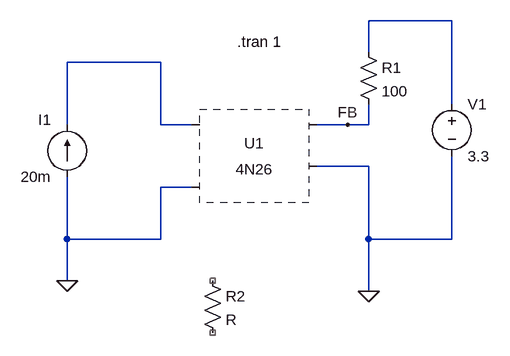
[diagram p0: schematic opto_trf.asc]
opto_trf.asc, the LTspice schematic file:
Version 4
SHEET 1 948 680
WIRE 848 -128 720 -128
WIRE 720 -80 720 -128
WIRE 400 -64 256 -64
WIRE 848 0 848 -128
WIRE 256 32 256 -64
WIRE 400 32 400 -64
WIRE 448 32 400 32
WIRE 688 32 640 32
WIRE 720 32 720 0
WIRE 720 32 688 32
WIRE 720 96 640 96
WIRE 448 128 400 128
WIRE 256 208 256 112
WIRE 400 208 400 128
WIRE 400 208 256 208
WIRE 720 208 720 96
WIRE 848 208 848 80
WIRE 848 208 720 208
WIRE 256 272 256 208
WIRE 720 288 720 208
FLAG 256 272 0
FLAG 720 288 0
FLAG 688 32 FB
SYMBOL current 256 112 R180
WINDOW 0 24 88 Left 0
WINDOW 3 24 0 Left 0
WINDOW 123 0 0 Left 0
WINDOW 39 0 0 Left 0
SYMATTR InstName I1
SYMATTR Value 20m
SYMBOL res 704 -96 R0
SYMATTR InstName R1
SYMATTR Value 100
SYMBOL voltage 848 -16 R0
WINDOW 123 0 0 Left 0
WINDOW 39 0 0 Left 0
SYMATTR InstName V1
SYMATTR Value 3.3
SYMBOL Optos\\4N26 544 96 R0
SYMATTR InstName U1
SYMBOL res 464 256 R0
SYMATTR InstName R2
TEXT 518 -96 Left 0 !.tran 1

The netlist it stands for:
* opto_trf.asc
I1 0 N002 20m
R1 N001 FB 100
V1 N001 0 3.3
* U1: 4N26 (symbol Optos\4N26 not available, pin order unknown); nets seen at it: 0, FB, N002
R2 NC_01 NC_02 R
.tran 1
.backanno
.end